# EAGLE schematic etch-fun (EAGLE 9.2.1)
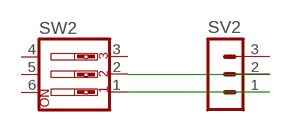
[diagram p0: schematic, sheet 1]

## Parts
SV2  MA03-1  [MA03-1]
SW2  SW_DIP-3  [EDG-03]

## Nets
N$1: SV2.1 SW2.1
N$2: SV2.2 SW2.2
Unconnected: SV2.3 SW2.3 SW2.4 SW2.5 SW2.6

## Library data of the parts
SV2 = con-lstb:MA03-1: PIN HEADER; OC_FARNELL: unknown; OC_NEWARK: unknown
SW2 = special:SW_DIP-3: DIP SWITCH